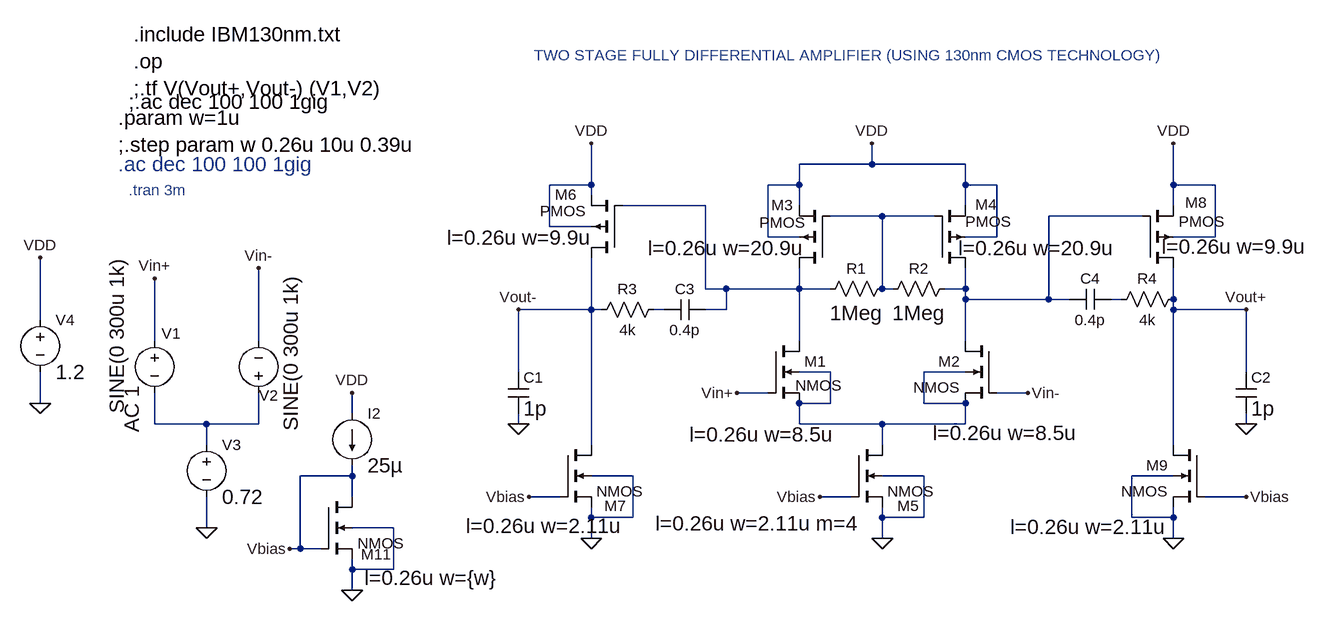
[diagram p0: schematic Abuzar-two-stage-diff-amp-ibm130nm.asc]
Abuzar-two-stage-diff-amp-ibm130nm.asc, the LTspice schematic file:
Version 4
SHEET 1 1516 680
WIRE 816 -192 816 -224
WIRE 816 -192 704 -192
WIRE 960 -192 816 -192
WIRE 384 -160 384 -224
WIRE 384 -160 320 -160
WIRE 704 -160 704 -192
WIRE 704 -160 656 -160
WIRE 960 -160 960 -192
WIRE 1008 -160 960 -160
WIRE 1280 -160 1280 -224
WIRE 1344 -160 1280 -160
WIRE 384 -144 384 -160
WIRE 560 -128 432 -128
WIRE 704 -128 704 -160
WIRE 960 -128 960 -160
WIRE 1280 -128 1280 -160
WIRE 832 -112 752 -112
WIRE 912 -112 832 -112
WIRE 1232 -112 1088 -112
WIRE 320 -96 320 -160
WIRE 384 -96 320 -96
WIRE 656 -80 656 -160
WIRE 704 -80 656 -80
WIRE 1008 -80 1008 -160
WIRE 1008 -80 960 -80
WIRE 1344 -80 1344 -160
WIRE 1344 -80 1280 -80
WIRE 560 0 560 -128
WIRE 592 0 560 0
WIRE 704 0 704 -32
WIRE 704 0 592 0
WIRE 752 0 704 0
WIRE 832 0 832 -112
WIRE 848 0 832 0
WIRE 960 0 960 -32
WIRE 960 0 928 0
WIRE 960 16 960 0
WIRE 1088 16 1088 -112
WIRE 1088 16 960 16
WIRE 1120 16 1088 16
WIRE 1200 16 1184 16
WIRE 1280 16 1280 -32
WIRE 384 32 384 -48
WIRE 384 32 272 32
WIRE 400 32 384 32
WIRE 496 32 480 32
WIRE 592 32 592 0
WIRE 592 32 560 32
WIRE 1280 32 1280 16
WIRE 1392 32 1280 32
WIRE -464 48 -464 -48
WIRE -288 80 -288 -16
WIRE -128 80 -128 -32
WIRE 704 80 704 0
WIRE 960 80 960 16
WIRE 272 128 272 32
WIRE 752 128 704 128
WIRE 960 128 896 128
WIRE 1392 128 1392 32
WIRE 656 160 608 160
WIRE 1056 160 1008 160
WIRE -464 176 -464 128
WIRE 752 176 752 128
WIRE 752 176 704 176
WIRE 896 176 896 128
WIRE 960 176 896 176
WIRE 16 192 16 160
WIRE -288 208 -288 160
WIRE -208 208 -288 208
WIRE -128 208 -128 160
WIRE -128 208 -208 208
WIRE 272 208 272 192
WIRE 704 208 704 176
WIRE 832 208 704 208
WIRE 960 208 960 176
WIRE 960 208 832 208
WIRE 1392 208 1392 192
WIRE -208 240 -208 208
WIRE 384 240 384 32
WIRE 832 240 832 208
WIRE 1280 240 1280 32
WIRE 16 288 16 272
WIRE 16 288 -64 288
WIRE 448 288 384 288
WIRE 896 288 832 288
WIRE 1280 288 1216 288
WIRE 16 320 16 288
WIRE 336 320 288 320
WIRE 784 320 736 320
WIRE 1392 320 1328 320
WIRE 384 352 384 336
WIRE 448 352 448 288
WIRE 448 352 384 352
WIRE 832 352 832 336
WIRE 896 352 896 288
WIRE 896 352 832 352
WIRE 1216 352 1216 288
WIRE 1280 352 1280 336
WIRE 1280 352 1216 352
WIRE -208 368 -208 320
WIRE 80 368 16 368
WIRE 384 384 384 352
WIRE 832 384 832 352
WIRE 1280 384 1280 352
WIRE -64 400 -64 288
WIRE -64 400 -80 400
WIRE -32 400 -64 400
WIRE 16 432 16 416
WIRE 80 432 80 368
WIRE 80 432 16 432
WIRE 16 464 16 432
FLAG 832 384 0
FLAG 1280 384 0
FLAG 384 384 0
FLAG 736 320 Vbias
FLAG 1392 320 Vbias
FLAG 288 320 Vbias
FLAG 608 160 Vin+
FLAG 1056 160 Vin-
FLAG 816 -224 VDD
FLAG 1280 -224 VDD
FLAG 384 -224 VDD
FLAG 1392 208 0
FLAG 272 208 0
FLAG 1392 32 Vout+
FLAG 272 32 Vout-
FLAG -208 368 0
FLAG -464 176 0
FLAG -464 -48 VDD
FLAG -288 -16 Vin+
FLAG -128 -32 Vin-
FLAG 16 464 0
FLAG -80 400 Vbias
FLAG 16 160 VDD
SYMBOL nmos4 656 80 R0
WINDOW 3 42 69 Left 2
WINDOW 123 -121 144 Left 3
SYMATTR Value2 l=0.26u w=8.5u
SYMATTR InstName M1
SYMBOL nmos4 1008 80 M0
WINDOW 123 -123 142 Left 3
SYMATTR Value2 l=0.26u w=8.5u
SYMATTR InstName M2
SYMBOL nmos4 784 240 R0
WINDOW 0 71 94 Left 2
WINDOW 123 -301 121 Left 3
SYMATTR InstName M5
SYMATTR Value2 l=0.26u w=2.11u m=4
SYMBOL nmos4 336 240 R0
WINDOW 0 68 94 Left 2
WINDOW 123 -145 125 Left 3
SYMATTR InstName M7
SYMATTR Value2 l=0.26u w=2.11u
SYMBOL nmos4 1328 240 M0
WINDOW 123 60 126 Left 3
SYMATTR Value2 l=0.26u w=2.11u
SYMATTR InstName M9
SYMBOL pmos4 752 -32 R180
WINDOW 0 57 97 Left 2
WINDOW 3 39 70 Left 2
WINDOW 123 42 31 Left 3
SYMATTR InstName M3
SYMATTR Value2 l=0.26u w=20.9u
SYMBOL pmos4 912 -32 M180
WINDOW 0 63 98 Left 2
WINDOW 3 48 72 Left 2
WINDOW 123 37 31 Left 3
SYMATTR InstName M4
SYMATTR Value2 l=0.26u w=20.9u
SYMBOL pmos4 1232 -32 M180
WINDOW 0 66 101 Left 2
WINDOW 123 30 33 Left 3
SYMATTR InstName M8
SYMATTR Value2 l=0.26u w=9.9u
SYMBOL pmos4 432 -48 R180
WINDOW 0 70 97 Left 2
WINDOW 123 49 31 Left 3
SYMATTR InstName M6
SYMATTR Value2 l=0.26u w=9.9u
SYMBOL cap 256 128 R0
WINDOW 3 24 56 Left 3
SYMATTR Value 1p
SYMATTR InstName C1
SYMBOL cap 1376 128 R0
WINDOW 3 24 56 Left 3
SYMATTR Value 1p
SYMATTR InstName C2
SYMBOL voltage -288 64 R0
WINDOW 0 11 5 Left 2
WINDOW 3 209 -83 VRight 3
WINDOW 123 -35 86 VRight 3
WINDOW 39 0 0 Left 0
SYMATTR InstName V1
SYMATTR Value SINE(0 300u 1k)
SYMATTR Value2 AC 1
SYMBOL voltage -128 176 R180
WINDOW 0 -30 12 Left 2
WINDOW 3 218 -16 VRight 3
WINDOW 123 0 0 Left 0
WINDOW 39 0 0 Left 0
SYMATTR InstName V2
SYMATTR Value SINE(0 300u 1k)
SYMBOL voltage -208 224 R0
WINDOW 3 24 96 Left 3
WINDOW 123 0 0 Left 0
WINDOW 39 0 0 Left 0
SYMATTR Value 0.72
SYMATTR InstName V3
SYMBOL voltage -464 32 R0
WINDOW 3 24 96 Left 3
WINDOW 123 0 0 Left 0
WINDOW 39 0 0 Left 0
SYMATTR Value 1.2
SYMATTR InstName V4
SYMBOL res 848 -16 R90
WINDOW 0 0 56 VBottom 2
WINDOW 3 32 56 VTop 3
SYMATTR InstName R1
SYMATTR Value 1Meg
SYMBOL res 944 -16 R90
WINDOW 0 0 56 VBottom 2
WINDOW 3 32 56 VTop 3
SYMATTR InstName R2
SYMATTR Value 1Meg
SYMBOL nmos4 -32 320 R0
WINDOW 0 62 89 Left 2
WINDOW 123 67 125 Left 3
SYMATTR InstName M11
SYMATTR Value2 l=0.26u w={w}
SYMBOL current 16 192 R0
WINDOW 3 24 80 Left 3
WINDOW 123 0 0 Left 0
WINDOW 39 0 0 Left 0
SYMATTR Value 25µ
SYMATTR InstName I2
SYMBOL cap 560 16 R90
WINDOW 0 0 32 VBottom 2
WINDOW 3 32 32 VTop 2
SYMATTR InstName C3
SYMATTR Value 0.4p
SYMBOL cap 1184 0 R90
WINDOW 0 0 32 VBottom 2
WINDOW 3 32 32 VTop 2
SYMATTR InstName C4
SYMATTR Value 0.4p
SYMBOL res 496 16 R90
WINDOW 0 0 56 VBottom 2
WINDOW 3 32 56 VTop 2
SYMATTR InstName R3
SYMATTR Value 4k
SYMBOL res 1296 0 R90
WINDOW 0 0 56 VBottom 2
WINDOW 3 32 56 VTop 2
SYMATTR InstName R4
SYMATTR Value 4k
TEXT -320 -392 Left 3 !.include IBM130nm.txt\n.op\n;.tf V(Vout+,Vout-) (V1,V2)
TEXT -344 -264 Left 3 !.param w=1u\n;.step param w 0.26u 10u 0.39u
TEXT -328 -288 Left 3 !;.ac dec 100 100 1gig
TEXT -344 -192 Left 3 ;.ac dec 100 100 1gig
TEXT 296 -360 Left 2 ;TWO STAGE FULLY DIFFERENTIAL AMPLIFIER (USING 130nm CMOS TECHNOLOGY)
TEXT -328 -152 Left 2 ;.tran 3m

The netlist it stands for:
* Abuzar-two-stage-diff-amp-ibm130nm.asc
M1 N001 Vin+ N006 N006 NMOS l=0.26u w=8.5u
M2 N003 Vin- N006 N006 NMOS l=0.26u w=8.5u
M5 N006 Vbias 0 0 NMOS l=0.26u w=2.11u m=4
M7 Vout- Vbias 0 0 NMOS l=0.26u w=2.11u
M9 Vout+ Vbias 0 0 NMOS l=0.26u w=2.11u
M3 N001 N002 VDD VDD PMOS l=0.26u w=20.9u
M4 N003 N002 VDD VDD PMOS l=0.26u w=20.9u
M8 Vout+ N003 VDD VDD PMOS l=0.26u w=9.9u
M6 Vout- N001 VDD VDD PMOS l=0.26u w=9.9u
C1 Vout- 0 1p
C2 Vout+ 0 1p
V1 Vin+ N007 SINE(0 300u 1k) AC 1
V2 N007 Vin- SINE(0 300u 1k)
V3 N007 0 0.72
V4 VDD 0 1.2
R1 N002 N001 1Meg
R2 N003 N002 1Meg
M11 Vbias Vbias 0 0 NMOS l=0.26u w={w}
I2 VDD Vbias 25µ
C3 N001 N005 0.4p
C4 N004 N003 0.4p
R3 N005 Vout- 4k
R4 Vout+ N004 4k
.model NMOS NMOS
.model PMOS PMOS
.lib standard.mos
.include IBM130nm.txt
.op
;.tf V(Vout+,Vout-) (V1,V2)
.param w=1u
;.step param w 0.26u 10u 0.39u
;.ac dec 100 100 1gig
* .ac dec 100 100 1gig
* TWO STAGE FULLY DIFFERENTIAL AMPLIFIER (USING 130nm CMOS TECHNOLOGY)
* .tran 3m
.backanno
.end